# EAGLE board Artemis Charger Mod PCB.2 (EAGLE 7.5.0), part 1 of 2
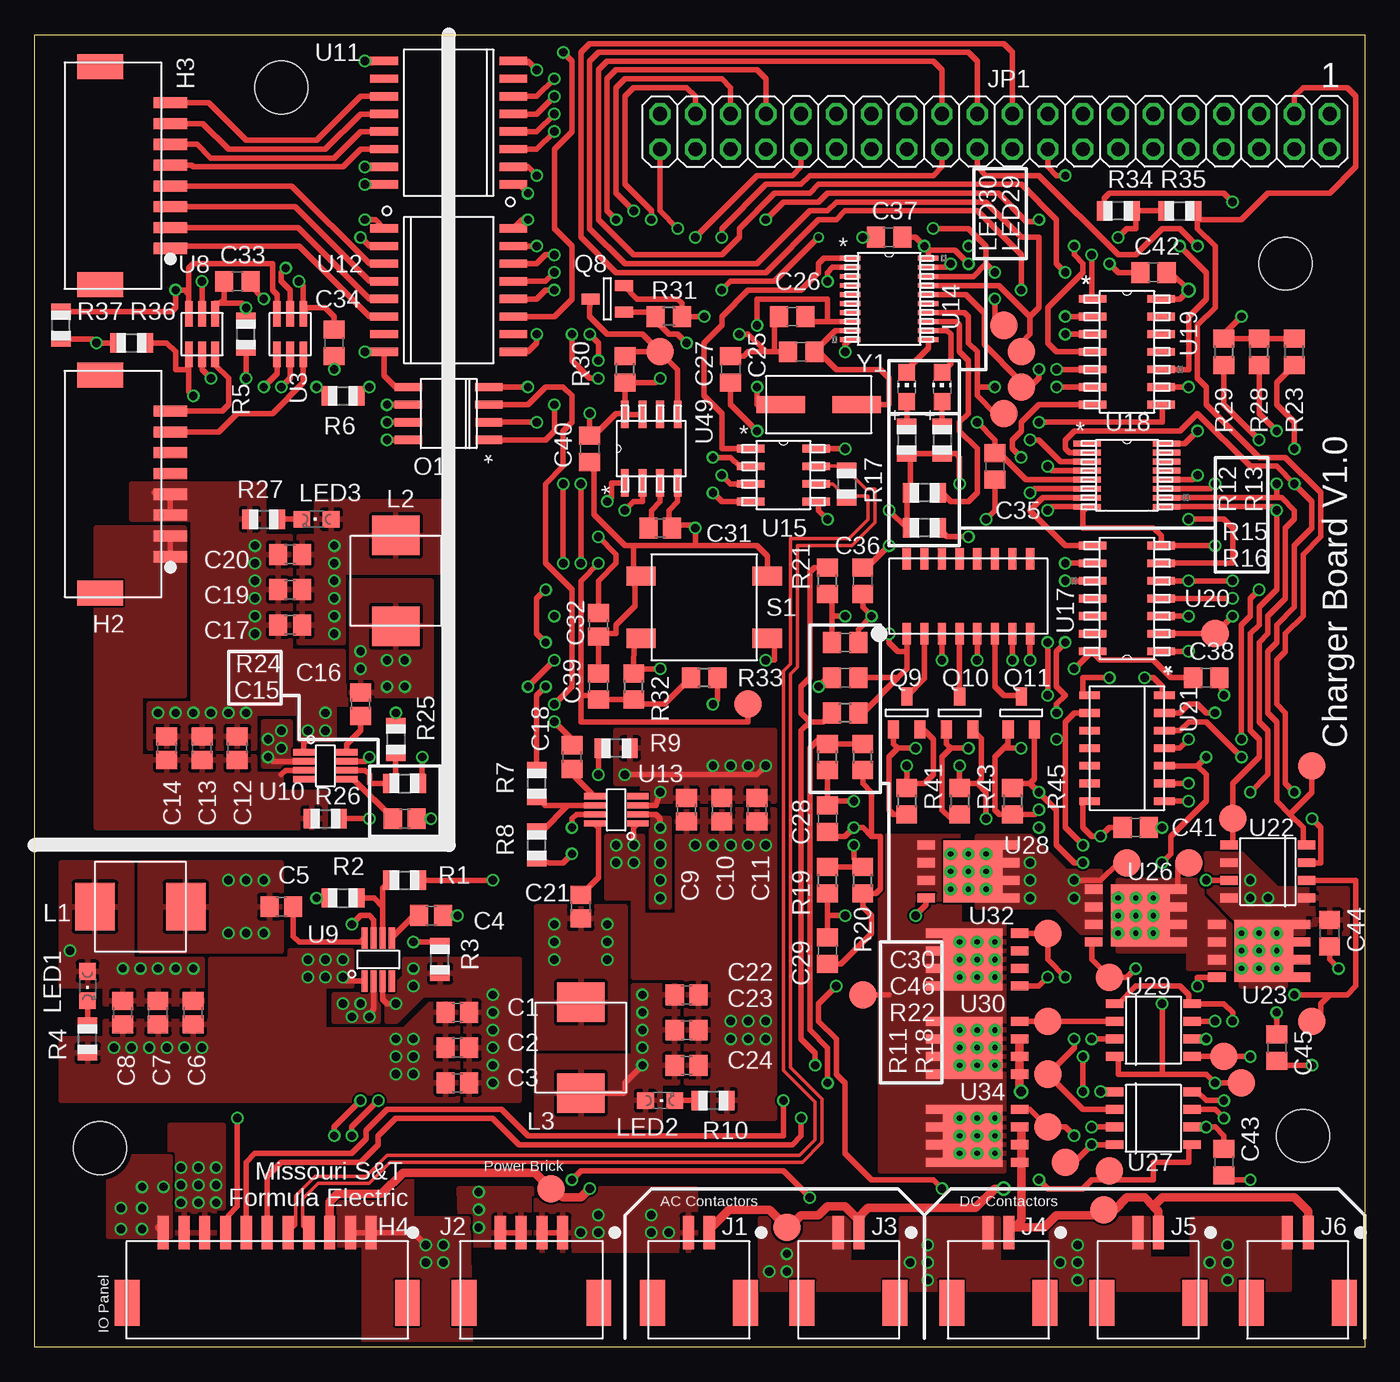
[diagram p2: board, top side]
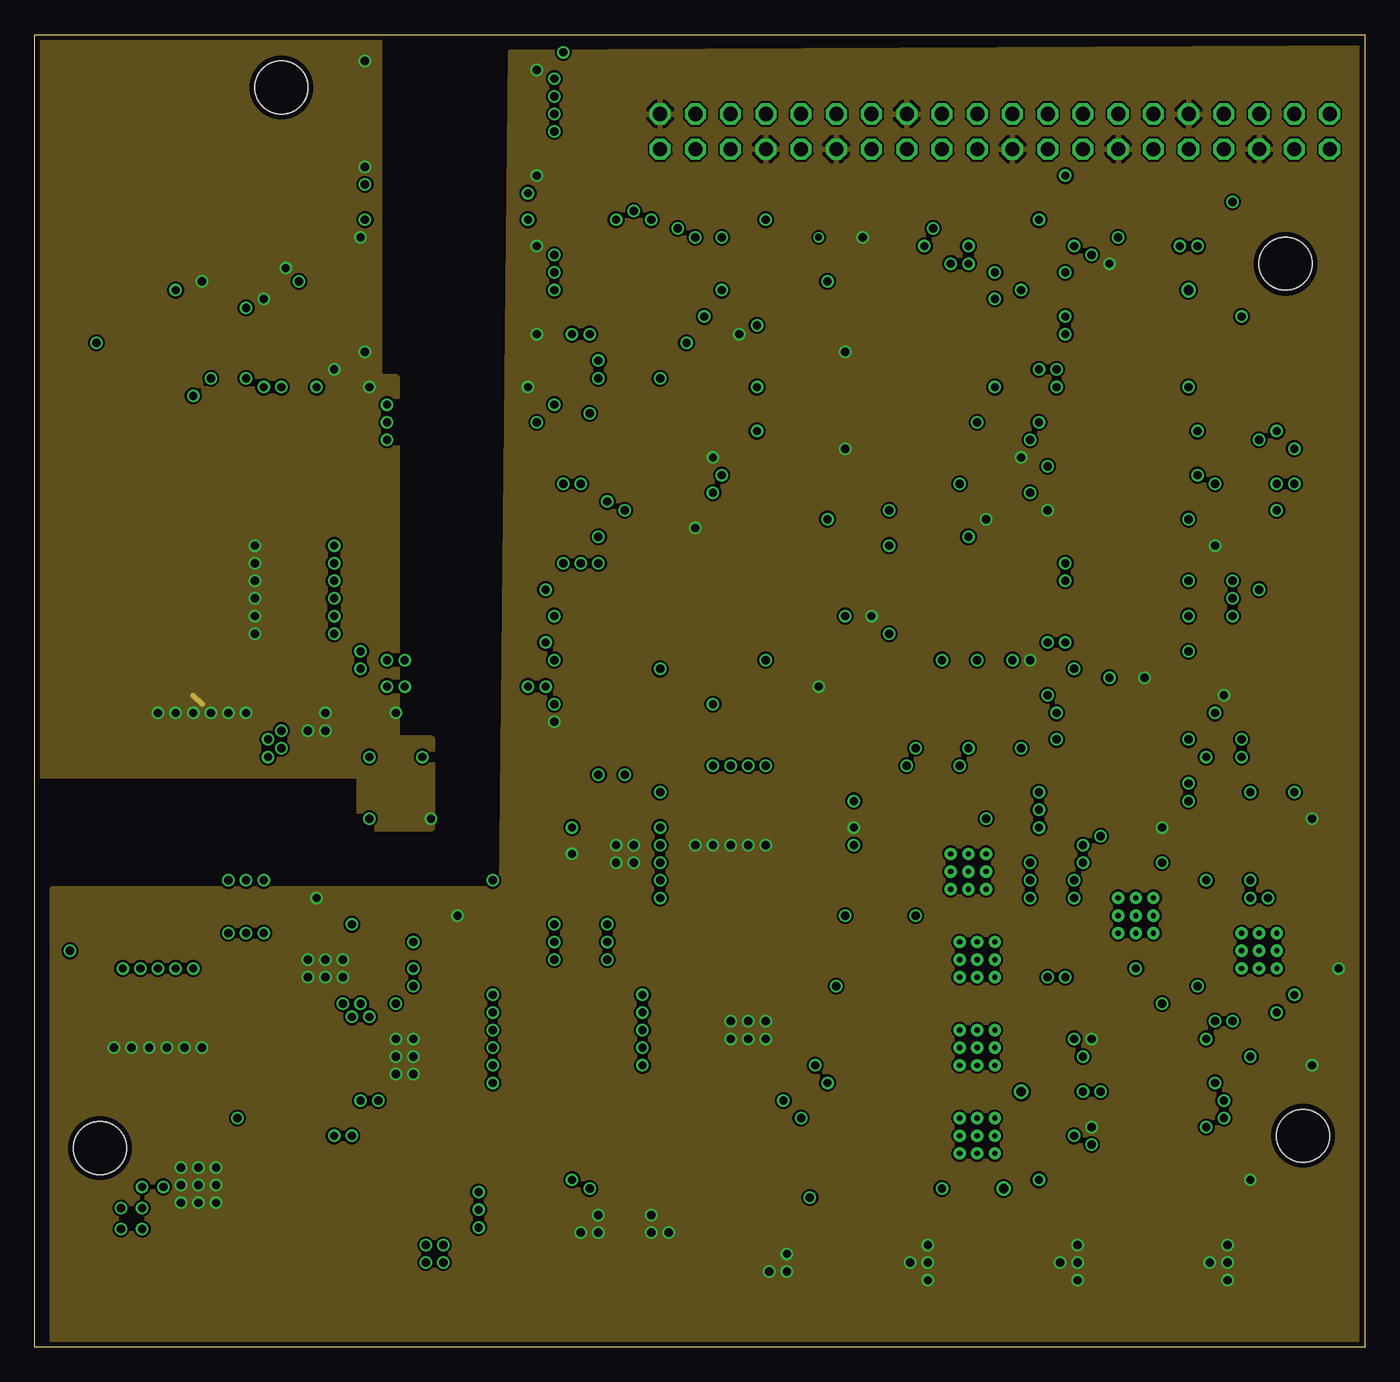
[diagram p3: board, inner layer Route2]
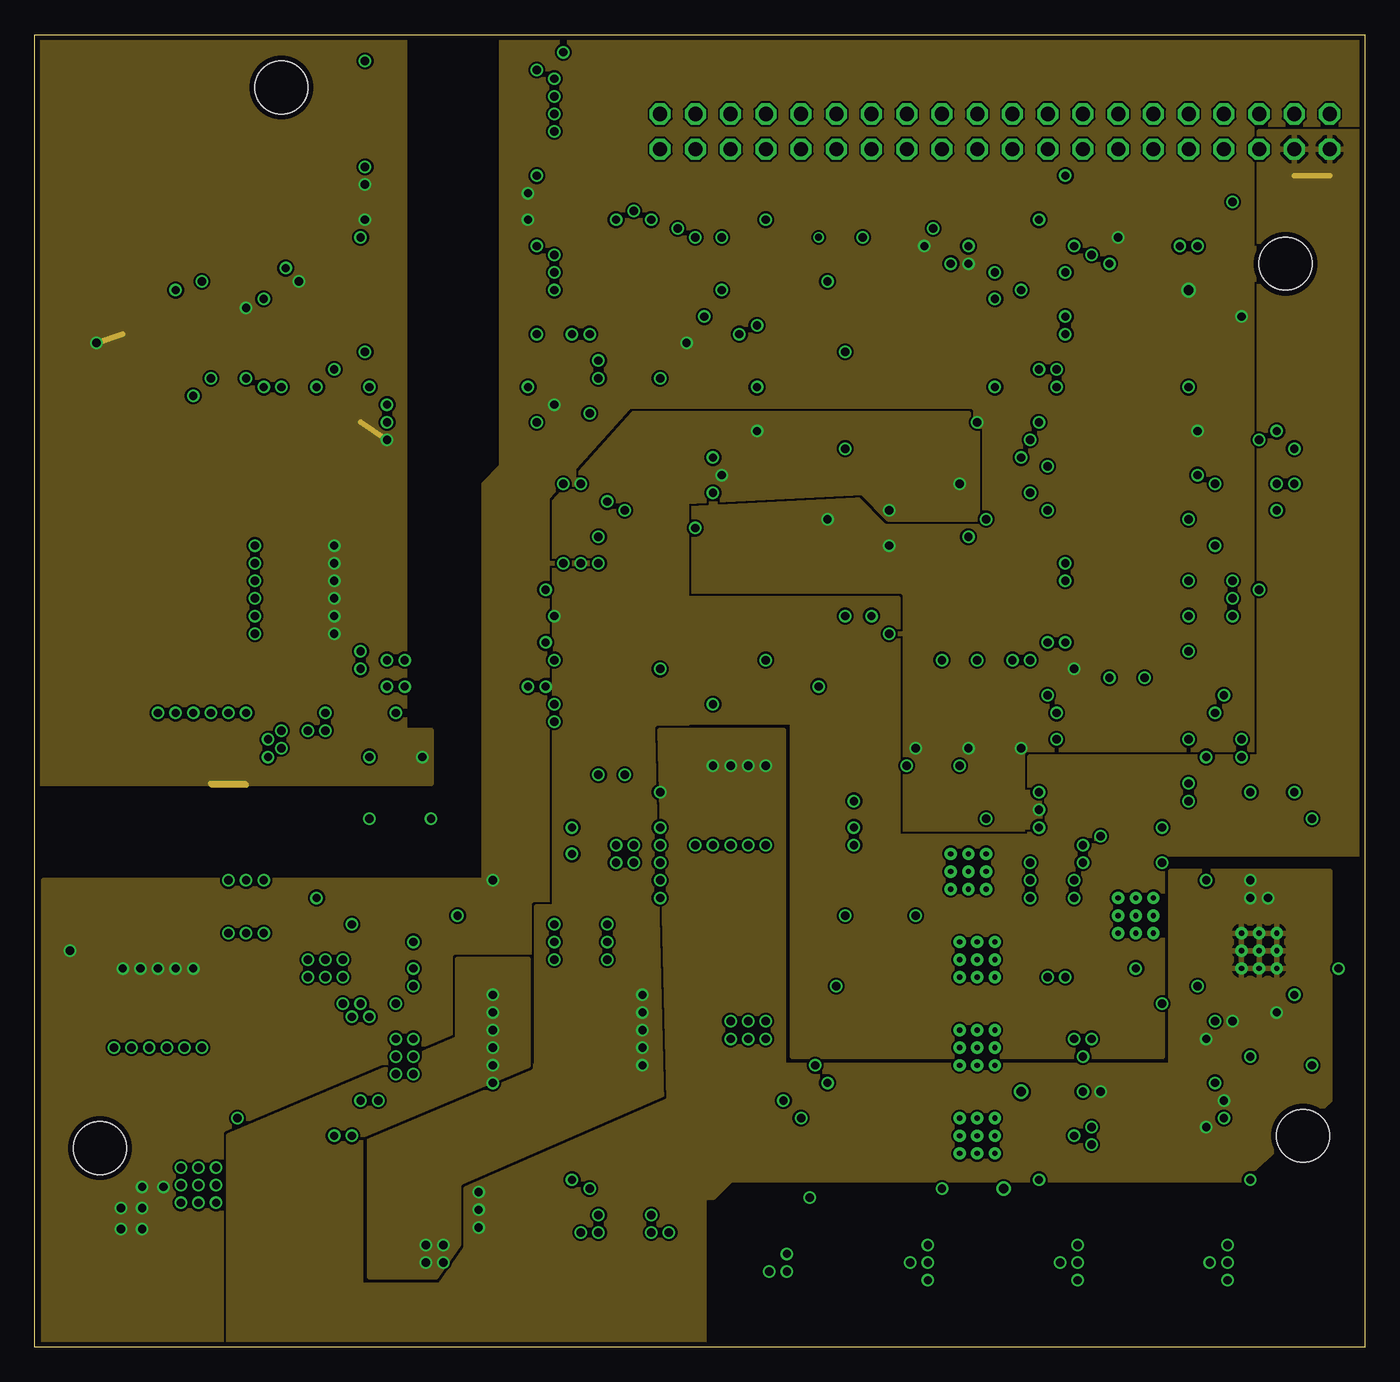
[diagram p4: board, inner layer Route15]
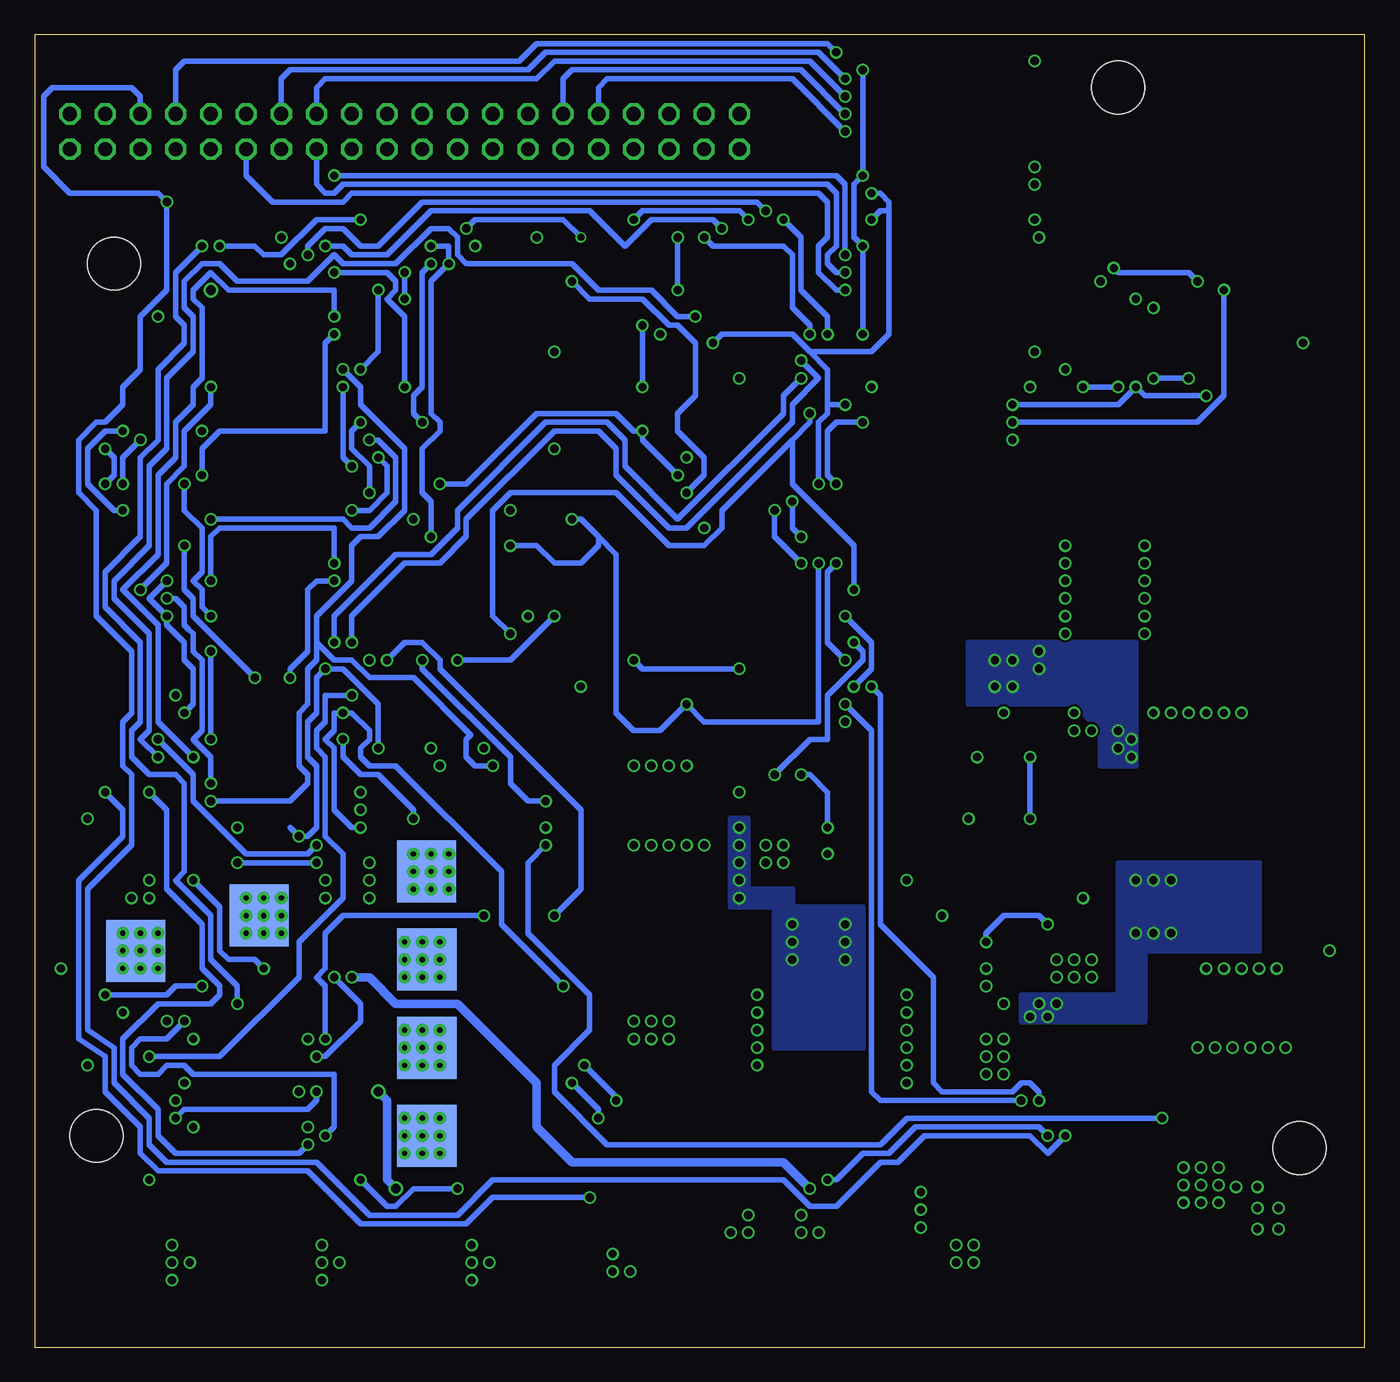
[diagram p5: board, bottom side, seen from below]

Size 95.89 x 94.62 mm. Coordinates in mm from the lower left corner, seen from the top.
Outline: 0,94.62 95.89,94.62 95.89,0 0,0 0,94.62
Copper layers (1*2*15*16): Top 0.035559375mm / dielectric 0.17018125mm / Route2 0.01778125mm / dielectric 47mil / Route15 0.01778125mm / dielectric 0.17018125mm / Bottom 0.035559375mm
Design rules "SierraCircuits-4layer *": minimum track width 10mil, minimum drill 10mil, track to track 6mil, track to pad 6mil, pad to pad 6mil, via to via 6mil, smd to smd 6mil, copper to edge 15mil, drill to drill 6mil, minimum pad ring 5mil, minimum via ring 5mil, stop-mask expansion 4mil, vias tented up to drill 0mil, thermal gap 10mil
Net classes: 1 CAN: width 0.254 mm, clearance 0.254 mm
Holes 3.81 mm at 17.78,90.81 90.17,78.11 91.44,15.24 4.7,14.35

## Footprints (pad centres in the part's own frame; a part is rotated, then mirrored left to right if it is on the bottom)
C0805 = smd 1.3 x 1.5: 1 -0.85,0; 2 0.85,0
C0805' = smd 1.3 x 1.5: 1 -0.95,0; 2 0.95,0
MOLEX-CLIKMATE-8-VERTICAL-HEADER = smd 0.8 x 2.4: 1 5.25,4.064; 2 3.75,4.064; 3 2.25,4.064; 4 0.75,4.064; 5 -0.75,4.064; 6 -2.25,4.064; 7 -3.75,4.064; 8 -5.25,4.064 | smd 1.8 x 3.3: M1 7.85,-0.986; M2 -7.85,-0.986
MOLEX_CLICKMATE-11-VERTICAL-HEADER = smd 0.8 x 2.4: 1 7.5,4.064; 2 6,4.064; 3 4.5,4.064; 4 3,4.064; 5 1.5,4.064; 6 0,4.064; 7 -1.5,4.064; 8 -3,4.064; 9 -4.5,4.064; 10 -6,4.064; 11 -7.5,4.064 | smd 1.8 x 3.3: M1 10.1,-0.986; M2 -10.1,-0.986
MOLEX-CLIKMATE-2-VERTICAL-HEADER = smd 0.8 x 2.4: 1 0.75,4.064; 2 -0.75,4.064 | smd 1.8 x 3.3: M1 3.35,-0.986; M2 -3.35,-0.986
MOLEX-CLIKMATE-4-VERTICAL-HEADER = smd 0.8 x 2.4: 1 2.25,4.064; 2 0.75,4.064; 3 -0.75,4.064; 4 -2.25,4.064 | smd 1.8 x 3.3: M1 4.85,-0.986; M2 -4.85,-0.986
2X20 = drill 1.016 octagon: 1 -24.13,-1.27; 2 -24.13,1.27; 3 -21.59,-1.27; 4 -21.59,1.27; 5 -19.05,-1.27; 6 -19.05,1.27; 7 -16.51,-1.27; 8 -16.51,1.27; 9 -13.97,-1.27; 10 -13.97,1.27; 11 -11.43,-1.27; 12 -11.43,1.27; 13 -8.89,-1.27; 14 -8.89,1.27; 15 -6.35,-1.27; 16 -6.35,1.27; 17 -3.81,-1.27; 18 -3.81,1.27; 19 -1.27,-1.27; 20 -1.27,1.27; 21 1.27,-1.27; 22 1.27,1.27; 23 3.81,-1.27; 24 3.81,1.27; 25 6.35,-1.27; 26 6.35,1.27; 27 8.89,-1.27; 28 8.89,1.27; 29 11.43,-1.27; 30 11.43,1.27; 31 13.97,-1.27; 32 13.97,1.27; 33 16.51,-1.27; 34 16.51,1.27; 35 19.05,-1.27; 36 19.05,1.27; 37 21.59,-1.27; 38 21.59,1.27; 39 24.13,-1.27; 40 24.13,1.27
SRP6540 = smd 2.85 x 3.4: P$1 -3.275,0; P$2 3.275,0
CHIPLED_0805 = smd 1.2 x 1.2: A 0,-1.05; C 0,1.05
CHIP-LED0805 = smd 1.2 x 1.2: A 0,-1.05; C 0,1.05
ISO1541 = smd 1.9 x 0.6: 1 -2.9,1.905; 2 -2.9,0.635 | smd 1.98 x 0.6: 3 -2.9,-0.635; 4 -2.9,-1.905; 5 2.9,-1.905; 6 2.9,-0.635; 7 2.9,0.635; 8 2.9,1.905
BSS138 = smd 0.8 x 1.3: D 0,1.2; G -0.95,-1.2; S 0.95,-1.2
R0805 = smd 1.1 x 1.4: 1 -1,0; 2 1,0
R0805' = smd 1.3 x 1.5: 1 -0.95,0; 2 0.95,0
TE-FSM4JSMATR = smd 1.4 x 2.1: 1 2.25,4.55; 2 2.25,-4.55; 3 -2.25,4.55; 4 -2.25,-4.55
TP20R = smd 2 x 2: TP 0,0
MAX5812 = smd 1.83 x 0.56: 1 -1.45,0.95; 2 -1.45,0; 3 -1.45,-0.95; 4 1.45,-0.95; 5 1.45,0; 6 1.45,0.95
TPS562219 = smd 1.55 x 0.45: 1 -1.55,0.975; 2 -1.55,0.325; 3 -1.55,-0.325; 4 -1.55,-0.975; 5 1.55,-0.975; 6 1.55,-0.325; 7 1.55,0.325; 8 1.55,0.975
ISO734X = smd 2 x 0.6: P$1 -4.65,4.445; P$2 -4.65,3.175; P$3 -4.65,1.905; P$4 -4.65,0.635; P$5 -4.65,-0.635; P$6 -4.65,-1.905; P$7 -4.65,-3.175; P$8 -4.65,-4.445; P$9 4.65,-4.445; P$10 4.65,-3.175; P$11 4.65,-1.905; P$12 4.65,-0.635; P$13 4.65,0.635; P$14 4.65,1.905; P$15 4.65,3.175; P$16 4.65,4.445
TSSOP20_MC = smd 1.473 x 0.356: 1 -2.819,2.925; 2 -2.819,2.275; 3 -2.819,1.625; 4 -2.819,0.975; 5 -2.819,0.325; 6 -2.819,-0.325; 7 -2.819,-0.975; 8 -2.819,-1.625; 9 -2.819,-2.275; 10 -2.819,-2.925; 11 2.819,-2.925; 12 2.819,-2.275; 13 2.819,-1.625; 14 2.819,-0.975; 15 2.819,-0.325; 16 2.819,0.325; 17 2.819,0.975; 18 2.819,1.625; 19 2.819,2.275; 20 2.819,2.925
SOIC8-N_MC = smd 1.981 x 0.559: 1 -2.362,1.905; 2 -2.362,0.635; 3 -2.362,-0.635; 4 -2.362,-1.905; 5 2.362,-1.905; 6 2.362,-0.635; 7 2.362,0.635; 8 2.362,1.905
SOIC-16 = smd 0.6 x 1.55: 1 0,0; 2 1.27,0; 3 2.54,0; 4 3.81,0; 5 5.08,0; 6 6.35,0; 7 7.62,0; 8 8.89,0; 9 8.89,5.4; 10 7.62,5.4; 11 6.35,5.4; 12 5.08,5.4; 13 3.81,5.4; 14 2.54,5.4; 15 1.27,5.4; 16 0,5.4
PW16-M = smd 1.981 x 0.406: 1 -2.87,2.275; 2 -2.87,1.625; 3 -2.87,0.975; 4 -2.87,0.325; 5 -2.87,-0.325; 6 -2.87,-0.975; 7 -2.87,-1.625; 8 -2.87,-2.275; 9 2.87,-2.275; 10 2.87,-1.625; 11 2.87,-0.975; 12 2.87,-0.325; 13 2.87,0.325; 14 2.87,0.975; 15 2.87,1.625; 16 2.87,2.275
D14 = smd 1.981 x 0.559: 1 -2.464,3.81; 2 -2.464,2.54; 3 -2.464,1.27; 4 -2.464,0; 5 -2.464,-1.27; 6 -2.464,-2.54; 7 -2.464,-3.81; 8 2.464,-3.81; 9 2.464,-2.54; 10 2.464,-1.27; 11 2.464,0; 12 2.464,1.27; 13 2.464,2.54; 14 2.464,3.81
SOIC-14 = smd 0.55 x 1.5: 1 -3.81,-2.7; 2 -2.54,-2.7; 3 -1.27,-2.7; 4 0,-2.7; 5 1.27,-2.7; 6 2.54,-2.7; 7 3.81,-2.7; 8 3.81,2.7; 9 2.54,2.7; 10 1.27,2.7; 11 0,2.7; 12 -1.27,2.7; 13 -2.54,2.7; 14 -3.81,2.7
LT-SOL8 = smd 1.27 x 0.635: 1 -2.794,1.905; 2 -2.794,0.635; 3 -2.794,-0.635; 4 -2.794,-1.905; 5 2.794,-1.905; 6 2.794,-0.635; 7 2.794,0.635; 8 2.794,1.905
SON_5X6 = smd 1.27 x 0.66: 1 3.048,-1.905; 2 3.048,-0.635; 3 3.048,0.635; 4 3.048,1.905; 5 -3.048,1.905; 6 -3.048,0.635; 7 -3.048,-0.635; 8 -3.048,-1.905 | smd 4.267 x 4.47 bottom: PAD -0.33,0 | smd 4.267 x 4.47: PAD1 -0.33,0 | drill 0.381 pad 0.889: VIA1 -1.27,1.27; VIA2 0,1.27; VIA3 1.27,1.27; VIA4 -1.27,0; VIA5 0,0; VIA6 1.27,0; VIA7 -1.27,-1.27; VIA8 0,-1.27; VIA9 1.27,-1.27
D8 = smd 1.981 x 0.559: 1 -2.464,1.905; 2 -2.464,0.635; 3 -2.464,-0.635; 4 -2.464,-1.905; 5 2.464,-1.905; 6 2.464,-0.635; 7 2.464,0.635; 8 2.464,1.905
CSM-3X = smd 3.5 x 1.2: P$1 2.75,0; P$2 -2.75,0

## Placement (x,y rotation side)
C1  0.1uF  [C0805]  30.48,24.13 180 top
C2  10uF  [C0805]  30.48,21.59 180 top
C3  10uF  [C0805]  30.48,19.05 180 top
C4  8200pF  [C0805]  28.58,31.12 0 top
C5  0.1uF  [C0805]  17.78,31.75 180 top
C6  22uF  [C0805]  11.43,24.13 270 top
C7  22uF  [C0805]  8.89,24.13 270 top
C8  22uF  [C0805]  6.35,24.13 270 top
C9  0.1uF  [C0805]  46.99,38.73 270 top
C10  10uF  [C0805]  49.53,38.73 270 top
C11  10uF  [C0805]  52.07,38.73 270 top
C12  0.1uF  [C0805]  14.61,43.18 90 top
C13  10uF  [C0805]  12.06,43.18 90 top
C14  10uF  [C0805]  9.53,43.18 90 top
C15  8200pF  [C0805]  26.67,38.1 0 top
C16  0.1uF  [C0805]  23.5,46.36 90 top
C17  22uF  [C0805]  18.42,52.07 180 top
C18  8200pF  [C0805]  38.73,42.55 90 top
C19  22uF  [C0805]  18.42,54.61 180 top
C20  22uF  [C0805]  18.42,57.15 180 top
C21  0.1uF  [C0805]  39.37,31.75 270 top
C22  22uF  [C0805]  46.99,25.4 0 top
C23  22uF  [C0805]  46.99,22.86 0 top
C24  22uF  [C0805]  46.99,20.32 0 top
C25  15pF  [C0805']  55.24,71.75 180 top
C26  15pF  [C0805']  54.61,74.3 180 top
C27  0.1uF  [C0805']  50.16,70.48 90 top
C28  DNP  [C0805']  57.15,38.1 270 top
C29  DNP  [C0805']  57.15,28.58 270 top
C30  DNP  [C0805']  58.42,50.8 0 top
C31  0.1uF  [C0805]  45.09,59.06 180 top
C32  0.1uF  [C0805]  40.64,52.07 90 top
C33  0.1uF  [C0805']  14.61,76.83 0 top
C34  0.1uF  [C0805']  21.59,72.39 270 top
C35  1uF  [C0805']  69.22,63.5 270 top
C36  1uF  [C0805']  59.69,55.25 270 top
C37  0.1uF  [C0805']  61.59,80.01 180 top
C38  0.1uF  [C0805']  84.45,48.26 0 top
C39  1uF  [C0805']  40.64,47.62 90 top
C40  1uF  [C0805']  40,64.77 270 top
C41  0.1uF  [C0805']  79.38,37.47 0 top
C42  0.1uF  [C0805']  80.65,77.47 180 top
C43  0.1uF  [C0805']  85.73,13.34 270 top
C44  0.1uF  [C0805']  93.34,29.84 270 top
C45  0.1uF  [C0805']  89.54,21.59 270 top
C46  0.1uF  [C0805']  58.42,48.26 180 top
H2  MOLEX_CLIKMATE-8-VERTICAL  [MOLEX-CLIKMATE-8-VERTICAL-HEADER]  5.71,62.23 270 top
H3  MOLEX_CLIKMATE-8-VERTICAL  [MOLEX-CLIKMATE-8-VERTICAL-HEADER]  5.71,84.45 270 top
H4  [MOLEX_CLICKMATE-11-VERTICAL-HEADER]  16.76,4.19 0 top
J1  MOLEX_CLICKMATE-2-VERTICAL  [MOLEX-CLIKMATE-2-VERTICAL-HEADER]  47.88,4.19 0 top
J2  MOLEX_CLICKMATE-4-VERTICAL  [MOLEX-CLIKMATE-4-VERTICAL-HEADER]  35.81,4.19 0 top
J3  MOLEX_CLICKMATE-2-VERTICAL  [MOLEX-CLIKMATE-2-VERTICAL-HEADER]  58.67,4.19 0 top
J4  MOLEX_CLICKMATE-2-VERTICAL  [MOLEX-CLIKMATE-2-VERTICAL-HEADER]  69.47,4.19 0 top
J5  MOLEX_CLICKMATE-2-VERTICAL  [MOLEX-CLIKMATE-2-VERTICAL-HEADER]  80.26,4.19 0 top
J6  MOLEX_CLICKMATE-2-VERTICAL  [MOLEX-CLIKMATE-2-VERTICAL-HEADER]  91.06,4.19 0 top
JP1  [2X20]  69.22,87.63 180 top
L1  4.7uH  [SRP6540]  7.62,31.75 180 top
L2  4.7uH  [SRP6540]  26.04,55.25 90 top
L3  4.7uH  [SRP6540]  39.37,21.59 270 top
LED1  GREEN  [CHIPLED_0805]  3.81,26.04 180 top
LED2  GREEN  [CHIPLED_0805]  45.09,17.78 270 top
LED3  GREEN  [CHIPLED_0805]  20.32,59.69 90 top
LED29  [CHIP-LED0805]  65.41,69.22 0 top
LED30  [CHIP-LED0805]  62.86,69.22 0 top
O1  ISO1541  [ISO1541]  29.85,67.31 180 top
Q8  BSS138  [BSS138]  41.27,75.56 90 top
Q9  BSS138  [BSS138]  62.86,45.72 0 top
Q10  BSS138  [BSS138]  66.68,45.72 0 top
Q11  BSS138  [BSS138]  71.12,45.72 0 top
R1  33.2k  [R0805]  26.67,33.66 0 top
R2  10K  [R0805]  22.23,32.39 0 top
R3  10K  [R0805]  29.21,27.94 90 top
R4  1K  [R0805]  3.81,22.23 90 top
R5  1K  [R0805]  15.24,73.03 90 top
R6  1K  [R0805]  22.23,68.58 0 top
R7  54.9k  [R0805]  36.2,40.64 90 top
R8  10K  [R0805]  36.2,36.2 90 top
R9  10K  [R0805]  41.91,43.18 180 top
R10  1K  [R0805]  48.89,17.78 180 top
R11  0  [R0805']  57.15,42.55 90 top
R12  330  [R0805]  62.86,65.41 270 top
R13  330  [R0805]  65.41,65.41 270 top
R15  2.2K  [R0805]  64.14,61.59 180 top
R16  2.2K  [R0805]  64.14,59.06 180 top
R17  120  [R0805]  58.55,62.23 270 top
R18  10k  [R0805']  59.69,42.55 90 top
R19  0  [R0805']  57.15,33.66 90 top
R20  10k  [R0805']  59.69,33.66 90 top
R21  0  [R0805']  57.15,55.25 90 top
R22  10k  [R0805']  58.42,45.72 180 top
R23  DNP  [R0805']  90.81,71.75 90 top
R24  54.9k  [R0805]  26.67,40.64 0 top
R25  10K  [R0805]  26.04,43.81 270 top
R26  10K  [R0805]  20.96,38.1 0 top
R27  1K  [R0805]  16.51,59.69 0 top
R28  DNP  [R0805']  88.27,71.75 90 top
R29  DNP  [R0805']  85.73,71.75 90 top
R30  10k  [R0805']  42.54,70.48 270 top
R31  10k  [R0805']  45.72,74.3 180 top
R32  100  [R0805']  43.18,47.62 90 top
R33  2.2K  [R0805']  48.26,48.26 180 top
R34  10K  [R0805]  78.11,81.92 180 top
R35  10K  [R0805]  82.55,81.92 0 top
R36  10K  [R0805]  6.98,72.39 0 top
R37  10K  [R0805]  1.91,73.66 90 top
R41  10k  [R0805']  62.86,39.37 270 top
R43  10k  [R0805']  66.68,39.37 270 top
R45  10k  [R0805']  70.48,39.37 270 top
S1  TE-FSM4JSMATR  [TE-FSM4JSMATR]  48.26,53.34 270 top
TP1  PTR1TP20R  [TP20R]  78.74,34.92 180 top
TP2  PTR1TP20R  [TP20R]  77.47,26.67 180 top
TP3  PTR1TP20R  [TP20R]  86.36,38.1 0 top
TP4  PTR1TP20R  [TP20R]  69.85,73.66 0 top
TP5  PTR1TP20R  [TP20R]  59.69,25.4 0 top
TP6  PTR1TP20R  [TP20R]  73.03,19.69 0 top
TP7  PTR1TP20R  [TP20R]  74.3,13.34 0 top
TP8  PTR1TP20R  [TP20R]  37.21,11.43 0 top
TP9  PTR1TP20R  [TP20R]  54.23,8.64 0 top
TP10  PTR1TP20R  [TP20R]  73.03,23.5 90 top
TP11  PTR1TP20R  [TP20R]  87,19.05 180 top
TP12  PTR1TP20R  [TP20R]  71.12,71.75 0 top
TP13  PTR1TP20R  [TP20R]  73.03,29.84 0 top
TP14  PTR1TP20R  [TP20R]  77.47,12.7 0 top
TP15  PTR1TP20R  [TP20R]  71.12,69.22 0 top
TP16  PTR1TP20R  [TP20R]  77.09,9.91 0 top
TP17  PTR1TP20R  [TP20R]  73.03,15.88 0 top
TP18  PTR1TP20R  [TP20R]  85.73,20.95 180 top
TP19  PTR1TP20R  [TP20R]  69.85,67.31 0 top
TP26  PTR1TP20R  [TP20R]  45.09,71.75 90 top
TP27  PTR1TP20R  [TP20R]  51.43,46.36 90 top
TP28  PTR1TP20R  [TP20R]  85.09,51.44 180 top
TP30  PTR1TP20R  [TP20R]  83.19,34.92 180 top
TP31  PTR1TP20R  [TP20R]  92.08,23.5 180 top
TP32  PTR1TP20R  [TP20R]  92.08,41.91 180 top
U3  MAX5812LEUT+TCT-ND  [MAX5812]  18.42,73.03 270 top
U8  MAX5812LEUT+TCT-ND  [MAX5812]  12.06,73.03 270 top
U9  TPS562219  [TPS562219]  24.77,27.94 90 top
U10  TPS562219  [TPS562219]  20.96,41.91 0 top
U11  ISO7340  [ISO734X]  29.85,88.27 180 top
U12  ISO7340  [ISO734X]  29.85,76.2 0 top
U13  TPS562219  [TPS562219]  41.91,38.73 180 top
U14  MCP2515-TSSOP  [TSSOP20_MC]  61.59,75.56 0 top
U15  MCP2562  [SOIC8-N_MC]  53.98,62.86 0 top
U17  CD4050BD  [SOIC-16]  62.86,51.44 0 top
U18  CD4043B  [PW16-M]  78.74,62.86 0 top
U19  SN74LVC08ASOIC  [D14]  78.74,71.75 0 top
U20  SN74LVC32ASOIC  [D14]  78.74,53.97 180 top
U21  [SOIC-14]  78.74,43.18 90 top
U22  LTC1155  [LT-SOL8]  88.9,34.29 180 top
U23  CSD17506Q5A  [SON_5X6]  88.27,28.58 180 top
U26  CSD17506Q5A  [SON_5X6]  79.38,31.12 180 top
U27  LTC1155  [LT-SOL8]  80.65,16.51 0 top
U28  CSD17506Q5A  [SON_5X6]  67.31,34.29 180 top
U29  LTC1155  [LT-SOL8]  80.65,22.86 0 top
U30  CSD17506Q5A  [SON_5X6]  67.95,21.59 0 top
U32  CSD17506Q5A  [SON_5X6]  67.95,27.94 0 top
U34  CSD17506Q5A  [SON_5X6]  67.95,15.24 0 top
U49  TL7712A-SOIC  [D8]  44.45,64.77 90 top
Y1  [CSM-3X]  56.52,67.95 180 top